# Altium schematic sheet Programming USB.SchDoc
size A
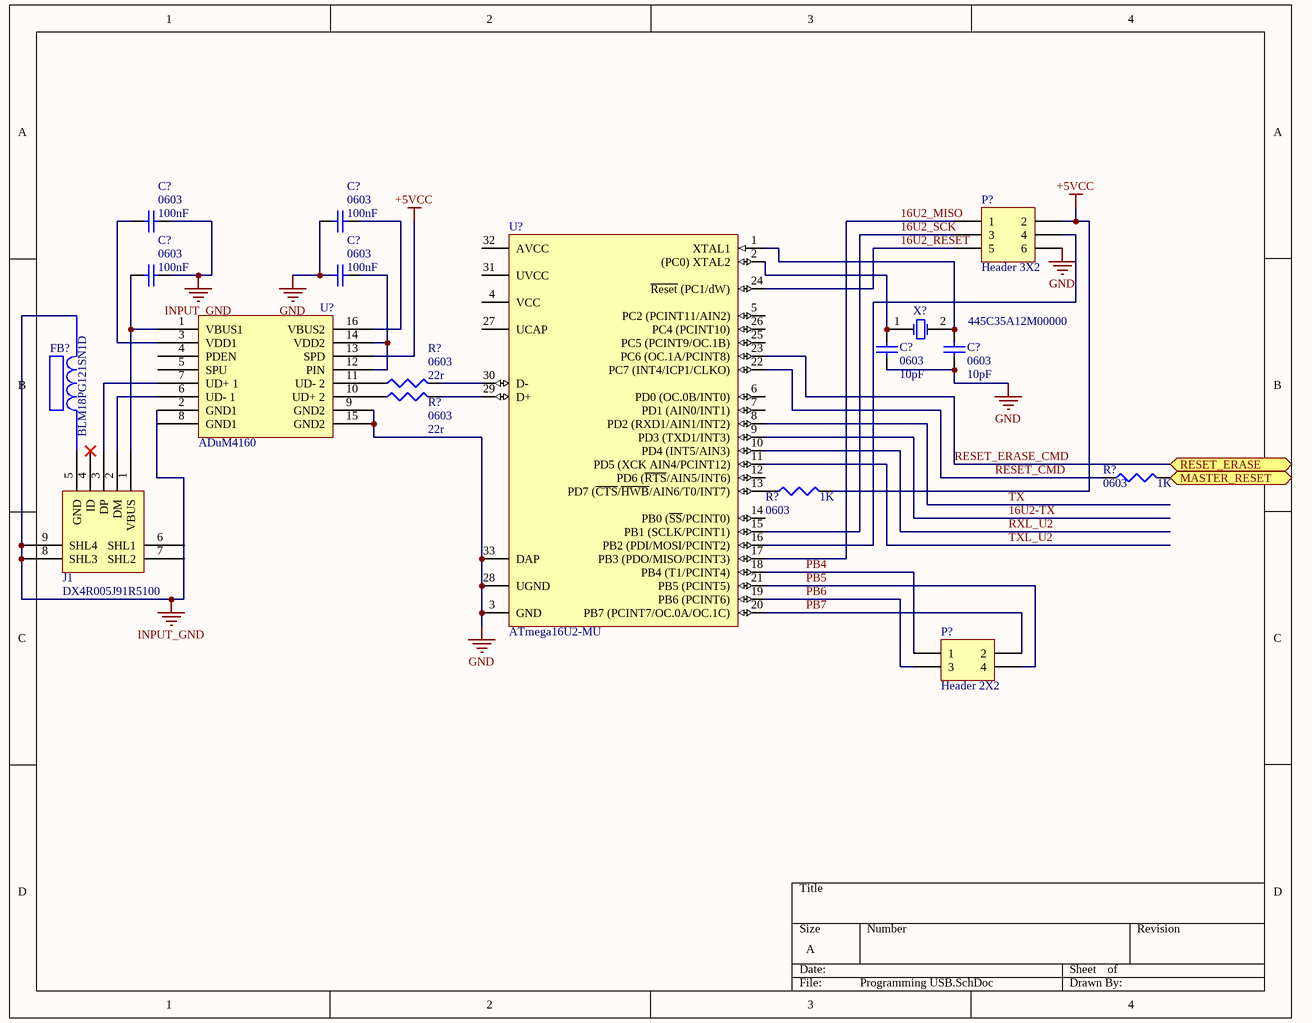
[diagram p0: Programming USB.SchDoc]

## Parts
(Parts that share a designator on the sheet are numbered #1, #2 ... from top to bottom, then left to right.)
C?#1  0603  value 100nF  [1608[0603]]
C?#2  0603  value 100nF  [1608[0603]]
C?#3  0603  value 100nF  [1608[0603]]
C?#4  0603  value 100nF  [1608[0603]]
C?#5  0603  value 10pF  [1608[0603]]
C?#6  0603  value 10pF  [1608[0603]]
FB?  BLM18PG121SN1D  [BLM18PG121SN1D]
J1  DX4R005J91R5100  [Micro USB Circular Holes Only]
P?#1  Header 3X2  [HDR2X3]
P?#2  Header 2X2  [HDR2X2]
R?#1  0603  value 22r  [J1-0603]
R?#2  0603  value 22r  [J1-0603]
R?#3  0603  value 1K  [J1-0603]
R?#4  0603  value 1K  [J1-0603]
U?#1  ATmega16U2-MU  [32PG_L]
U?#2  ADuM4160  [ADuM4160]
X?  445C35A12M00000  [R38]

## Ports
MASTER_RESET, RESET_ERASE

## Nets
+5VCC: P?#1.2 R?#4.2 U?#2.13(SPD)
GND: C?#2.2 C?#4.2 C?#5.1 C?#6.1 P?#1.6 U?#1.3(GND) U?#1.28(UGND) U?#1.33(DAP) U?#2.9(GND2) U?#2.15(GND2)
INPUT_GND: C?#1.1 C?#3.1 FB?.2 J1.8(SHL3) J1.9(SHL4)
16U2-TX: U?#1.9(PD3_(TXD1/INT3))
16U2_MISO: P?#1.1 U?#1.17(PB3_(PDO/MISO/PCINT3))
16U2_RESET: P?#1.5 U?#1.24(~{Reset}_(PC1/dW))
16U2_SCK: P?#1.3 U?#1.15(PB1_(SCLK/PCINT1))
MASTER_RESET: R?#3.2 ; port MASTER_RESET
PB4: P?#2.1 U?#1.18(PB4_(T1/PCINT4))
PB5: P?#2.4 U?#1.21(PB5_(PCINT5))
PB6: P?#2.3 U?#1.19(PB6_(PCINT6))
PB7: P?#2.2 U?#1.20(PB7_(PCINT7/OC.0A/OC.1C))
RESET_CMD: R?#3.1 U?#1.22(PC7_(INT4/ICP1/CLKO))
RESET_ERASE_CMD: U?#1.23(PC6_(OC.1A/PCINT8)) ; port RESET_ERASE
RXL_U2: U?#1.10(PD4_(INT5/AIN3))
TX: U?#1.8(PD2_(RXD1/AIN1/INT2))
TXL_U2: U?#1.11(PD5_(XCK_AIN4/PCINT12))
NetC?#1_2: C?#1.2 U?#2.3(VDD1)
NetC?#2_1: C?#2.1 U?#2.16(VBUS2)
NetC?#3_2: C?#3.2 J1.1(VBUS) U?#2.1(VBUS1)
NetC?#4_1: C?#4.1 U?#2.12(PIN) U?#2.14(VDD2)
NetC?#5_2: C?#5.2 U?#1.2((PC0)_XTAL2) X?.1(OSC1)
NetC?#6_2: C?#6.2 U?#1.1(XTAL1) X?.2(OSC2)
NetFB?_1: FB?.1 J1.5(GND)
NetJ1_2: J1.2(DM) U?#2.6(UD-_1)
NetJ1_3: J1.3(DP) U?#2.7(UD+_1)
NetP?#1_4: P?#1.4 U?#1.16(PB2_(PDI/MOSI/PCINT2))
NetR?#1_1: R?#1.1 U?#2.11(UD-_2)
NetR?#1_2: R?#1.2 U?#1.30(D-)
NetR?#2_1: R?#2.1 U?#2.10(UD+_2)
NetR?#2_2: R?#2.2 U?#1.29(D+)
NetR?#4_1: R?#4.1 U?#1.13(PD7_(~{CTS}/~{HWB}/AIN6/T0/INT7))

Not connected (* = marked no-connect by the designer): J1 4(ID)* 6(SHL1) 7(SHL2); U?#1 4(VCC) 5(PC2_(PCINT11/AIN2)) 6(PD0_(OC.0B/INT0)) 7(PD1_(AIN0/INT1)) 12(PD6_(~{RTS}/AIN5/INT6)) 14(PB0_(~{SS}/PCINT0)) 25(PC5_(PCINT9/OC.1B)) 26(PC4_(PCINT10)) 27(UCAP) 31(UVCC) 32(AVCC); U?#2 2(GND1) 4(PDEN) 5(SPU) 8(GND1)

## Library data of the parts
C?#1-C?#6 = Cap Semi: Capacitor (Semiconductor SIM Model); Published: 8-Jun-2000; LatestRevisionDate: 29-May-2009; LatestRevisionNote: IPC-7351 Footprint Added.; PackageReference: C1206; Publisher: Altium Limited; PackageDescription: Chip Capacitor
J1 = Micro USB: Micro USB Jack B
P?#1 = Header 3X2: Header, 3-Pin, Dual row; LatestRevisionDate: 17-Jul-2002; LatestRevisionNote: Re-released for DXP Platform.; Publisher: Altium Limited
P?#2 = Header 2X2: Header, 2-Pin, Dual row; LatestRevisionDate: 17-Jul-2002; LatestRevisionNote: Re-released for DXP Platform.; Publisher: Altium Limited
R?#1-R?#4 = Res3: Resistor; Published: 8-Jun-2000; LatestRevisionDate: 29-May-2009; LatestRevisionNote: IPC-7351 Footprint Added.; PackageReference: J1-0603; Publisher: Altium Limited; PackageDescription: Chip Resistor
U?#1 = ATmega16U2-MU: 8-bit AVR Microcontroller, 2.7-5.5V, 16KB Flash, 512 Bytes EEPROM, 512 Bytes SRAM, 32-pin VQFN, Industrial Grade (-40°C to 85°C); DatasheetVersion: revD, Nov-2010; PackageVersion: revA, Oct-2008; PackageReference: 32PG; PackageDescription: 32-Pin Quad Flat No-Lead (QFN) Sawn,  5 x 5 x 1.0 mm Body, Pitch 0.50 mm, 3.60mm Exposed Pad; Code_JEDEC: MO-220WHHD-2; ComponentLink1Description: Manufacturer URL; ComponentLink1URL: http://www.atmel.com/; ComponentLink2Description: ATmega8U2/16U2/32U2 Datasheet; ComponentLink2URL: http://www.atmel.com/dyn/resources/prod_documents/doc7799.pdf; ComponentLink3Description: ATmega8U2/16U2/32U2 Summary; ComponentLink3URL: http://www.atmel.com/dyn/resources/prod_documents/7799S.pdf
U?#2 = ADuM4160: USB Opto Isolator
X? = XTAL: Crystal Oscillator; Published: 8-Jun-2000; LatestRevisionDate: 17-Jul-2002; LatestRevisionNote: Re-released for DXP Platform.; PackageReference: R38; Publisher: Altium Limited; PackageDescription: Crystal, Thru-Hole; 2 Leads; Body 3.1 x 8.2 mm (Dia.xH)